# EAGLE design expbox (EAGLE 9.6.2)
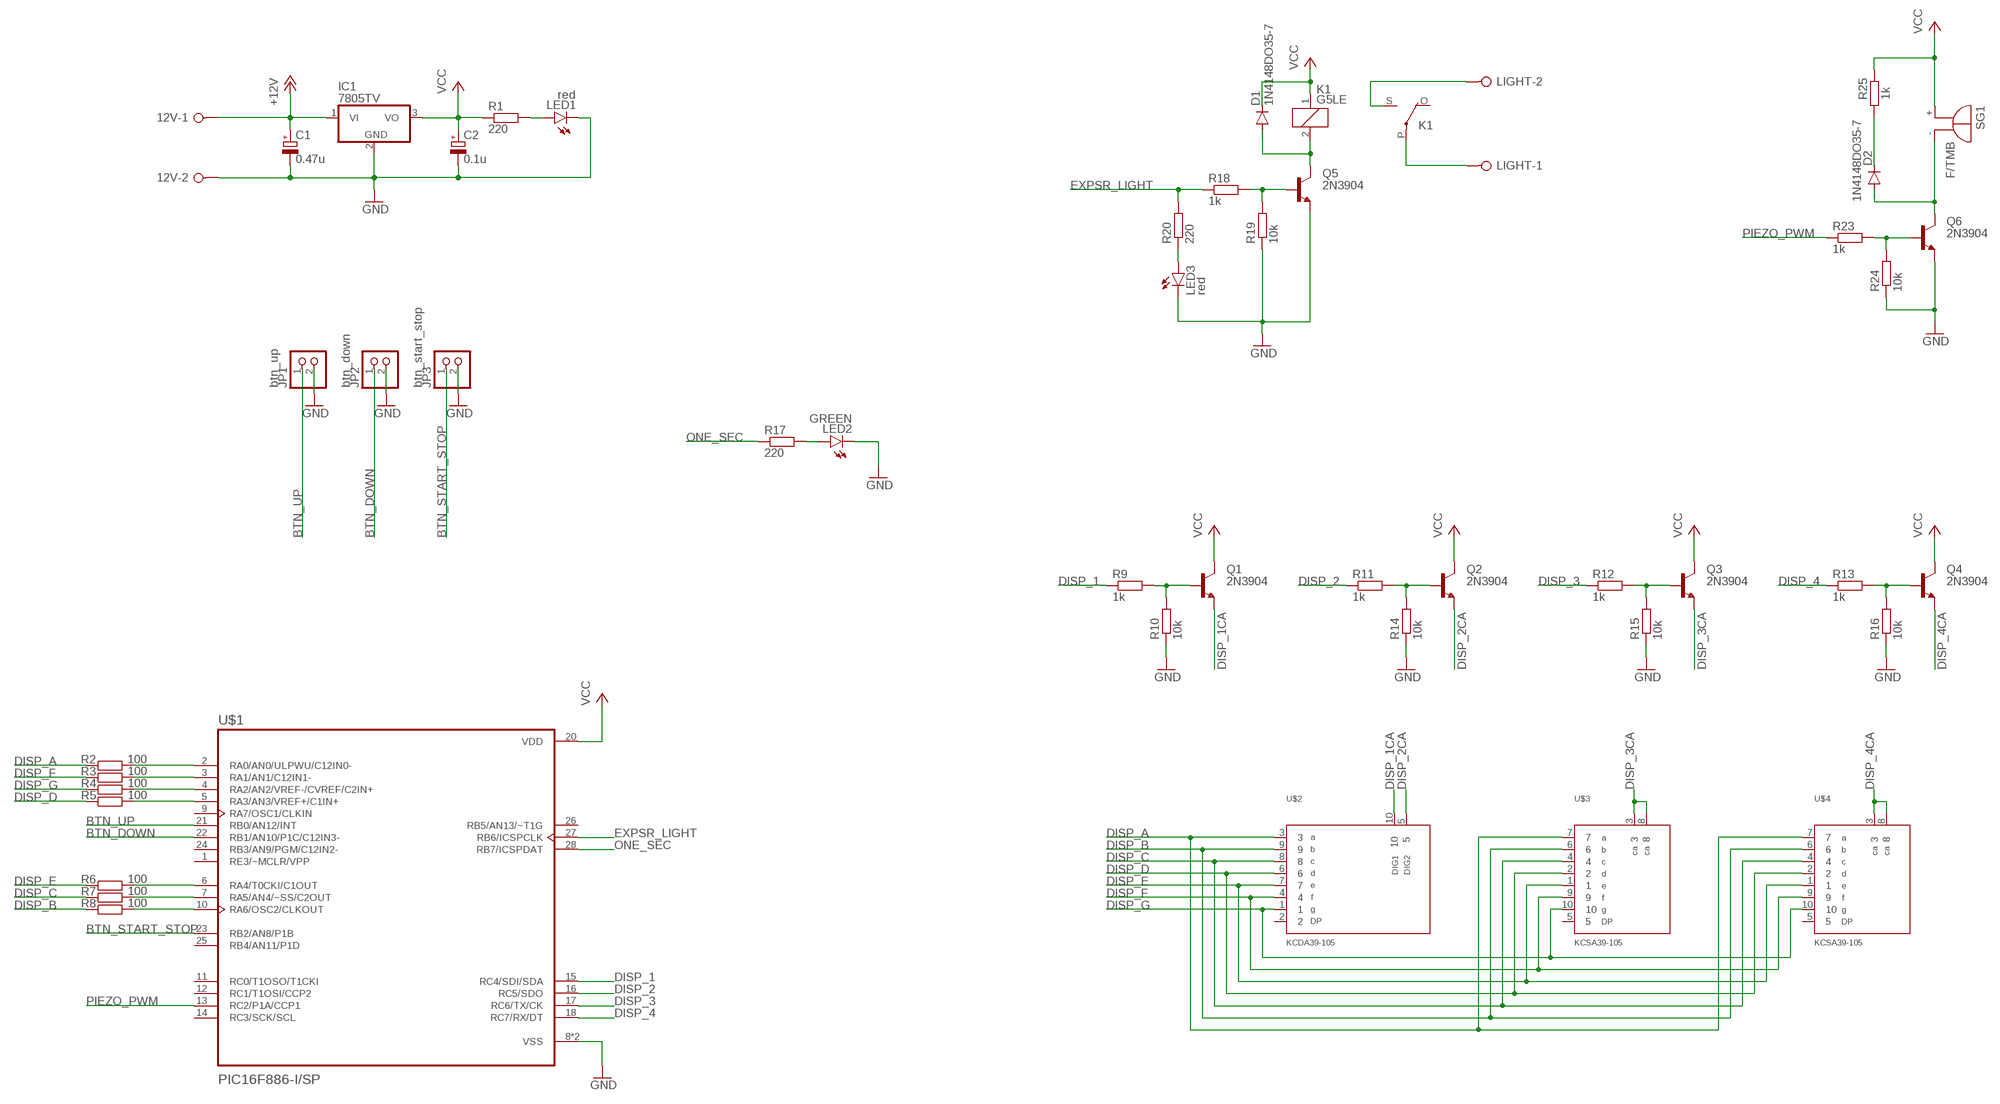
[diagram p0: schematic, sheet 1]

## Parts
12V  W237-02P  [W237-132]
C1  0.47u  CPOL-EUE2.5-5  [E2,5-5]
C2  0.1u  CPOL-EUE2-4  [E2-4]
D1  1N4148DO35-7  [DO35-7]
D2  1N4148DO35-7  [DO35-7]
IC1  7805TV  [TO220V]
JP1  btn_up  PINHD-1X2  [1X02]
JP2  btn_down  PINHD-1X2  [1X02]
JP3  btn_start_stop  PINHD-1X2  [1X02]
K1  G5LE  [G5LE]
LED1  red  LED3MM  [LED3MM]
LED2  GREEN  LEDSMT1206  [1206]
LED3  red  LED3MM  [LED3MM]
LIGHT  W237-02P  [W237-132]
Q1  2N3904  BC850SMD  [SOT23-BEC]
Q2  2N3904  BC850SMD  [SOT23-BEC]
Q3  2N3904  BC850SMD  [SOT23-BEC]
Q4  2N3904  BC850SMD  [SOT23-BEC]
Q5  2N3904  BC850SMD  [SOT23-BEC]
Q6  2N3904  BC850SMD  [SOT23-BEC]
R1  220  R-EU_R0805  [R0805]
R2  100  R-EU_M1206  [M1206]
R3  100  R-EU_M1206  [M1206]
R4  100  R-EU_M1206  [M1206]
R5  100  R-EU_M1206  [M1206]
R6  100  R-EU_M1206  [M1206]
R7  100  R-EU_M1206  [M1206]
R8  100  R-EU_M1206  [M1206]
R9  1k  R-EU_R0805  [R0805]
R10  10k  R-EU_R0805  [R0805]
R11  1k  R-EU_R0805  [R0805]
R12  1k  R-EU_R0805  [R0805]
R13  1k  R-EU_R0805  [R0805]
R14  10k  R-EU_R0805  [R0805]
R15  10k  R-EU_R0805  [R0805]
R16  10k  R-EU_R0805  [R0805]
R17  220  R-EU_R0805  [R0805]
R18  1k  R-EU_R0805  [R0805]
R19  10k  R-EU_R0805  [R0805]
R20  220  R-EU_R0805  [R0805]
R23  1k  R-EU_R0805  [R0805]
R24  10k  R-EU_R0805  [R0805]
R25  1k  R-EU_R0805  [R0805]
SG1  F/TMB  [F/TMB]
U$1  PIC16F886-I/SP  [DIP762W46P254L3467H457Q28]
U$2  KCDA39-105  [KCDA39-105]
U$3  KCSA39-105  [KCSA39-105]
U$4  KCSA39-105  [KCSA39-105]

## Nets
+12V: 12V.1 C1.+ IC1.1(VI)
BTN_DOWN: JP2.1 U$1.22(RB1/AN10/P1C/C12IN3-)
BTN_START_STOP: JP3.1 U$1.23(RB2/AN8/P1B)
BTN_UP: JP1.1 U$1.21(RB0/AN12/INT)
DISP_1: R9.1 U$1.15(RC4/SDI/SDA)
DISP_1CA: Q1.E U$2.10
DISP_2: R11.1 U$1.16(RC5/SDO)
DISP_2CA: Q2.E U$2.5
DISP_3: R12.1 U$1.17(RC6/TX/CK)
DISP_3CA: Q3.E U$3.3 U$3.8
DISP_4: R13.1 U$1.18(RC7/RX/DT)
DISP_4CA: Q4.E U$4.3 U$4.8
DISP_A: R2.1 U$2.3 U$3.7 U$4.7
DISP_B: R8.1 U$2.9 U$3.6 U$4.6
DISP_C: R7.1 U$2.8 U$3.4 U$4.4
DISP_D: R5.1 U$2.6 U$3.2 U$4.2
DISP_E: R6.1 U$2.7 U$3.1 U$4.1
DISP_F: R3.1 U$2.4 U$3.9 U$4.9
DISP_G: R4.1 U$2.1 U$3.10 U$4.10
EXPSR_LIGHT: R18.1 R20.2 U$1.27(RB6/ICSPCLK)
GND: 12V.2 C1.- C2.- IC1.2(GND) JP1.2 JP2.2 JP3.2 LED1.K(C) LED2.C LED3.K(C) Q5.E Q6.E R10.1 R14.1 R15.1 R16.1 R19.1 R24.1 U$1.8(VSS) U$1.19(VSS)
N$1: LED1.A R1.2
N$2: R2.2 U$1.2(RA0/AN0/ULPWU/C12IN0-)
N$3: R3.2 U$1.3(RA1/AN1/C12IN1-)
N$4: R4.2 U$1.4(RA2/AN2/VREF-/CVREF/C2IN+)
N$5: R5.2 U$1.5(RA3/AN3/VREF+/C1IN+)
N$6: R6.2 U$1.6(RA4/T0CKI/C1OUT)
N$7: R7.2 U$1.7(RA5/AN4/~SS/C2OUT)
N$8: R8.2 U$1.10(RA6/OSC2/CLKOUT)
N$9: Q2.B R11.2 R14.2
N$10: Q1.B R9.2 R10.2
N$11: Q3.B R12.2 R15.2
N$12: Q4.B R13.2 R16.2
N$13: LED2.A R17.2
N$14: K1.S(2:S) LIGHT.2
N$15: Q5.B R18.2 R19.2
N$16: D1.A K1.2 Q5.C
N$17: K1.P(2:P) LIGHT.1
N$18: LED3.A R20.1
N$21: D2.A Q6.C SG1.-
N$24: Q6.B R23.2 R24.2
N$25: D2.C R25.1
ONE_SEC: R17.1 U$1.28(RB7/ICSPDAT)
PIEZO_PWM: R23.1 U$1.13(RC2/P1A/CCP1)
VCC: C2.+ D1.C IC1.3(VO) K1.1 Q1.C Q2.C Q3.C Q4.C R1.1 R25.2 SG1.+ U$1.20(VDD)
Unconnected: K1.O(2:O) U$1.1(RE3/~MCLR/VPP) U$1.9(RA7/OSC1/CLKIN) U$1.11(RC0/T1OSO/T1CKI) U$1.12(RC1/T1OSI/CCP2) U$1.14(RC3/SCK/SCL) U$1.24(RB3/AN9/PGM/C12IN2-) U$1.25(RB4/AN11/P1D) U$1.26(RB5/AN13/~T1G) U$2.2 U$3.5 U$4.5

## Library data of the parts
12V LIGHT = con-wago-508:W237-02P: WAGO SREW CLAMP; OC_FARNELL: unknown; OC_NEWARK: unknown
C1 C2 = rcl:CPOL-EU: POLARIZED CAPACITOR, European symbol; SPICEPREFIX: C
D1 D2 = diode:1N4148: DIODE high speed (Philips)
IC1 = linear:78*: Positive VOLTAGE REGULATOR Source: http://cache.national.com/ds/LM/LM78L05.pdf http://www.fairchildsemi.com/ds/LM/LM7805.pdf
JP1-JP3 = pinhead:PINHD-1X2: PIN HEADER
K1 = relay:G5LE: RELAY 1 x switch, 10 A/120 V AC, 8 A/30 V DC, Omron; OC_FARNELL: unknown; OC_NEWARK: unknown
LED1-LED3 = led:LED: LED OSRAM: - CHIPLED LG R971, LG N971, LY N971, LG Q971, LY Q971, LO R971, LY R971 LH N974, LH R974 LS Q976, LO Q976, LY Q976 LO Q996 - Hyper CHIPLED LW Q18S LB Q993, LB Q99A, LB R99A - SideLED LS A670, LO A670, LY A670, LG A670, LP A670 LB A673, LV A673, LT A673, LW A673 LH A674 LY A675 LS A676, LA A676, LO A676, LY A676, LW A676 LS A679, LY A679, LG A679 - Hyper Micro SIDELED® LS Y876, LA Y876, LO Y876, LY Y876 LT Y87S - SmartLED LW L88C, LW L88S LB L89C, LB L89S, LG L890 LS L89K, LO L89K, LY L89K LS L896, LA L896, LO L896, LY L896 - TOPLED LS T670, LO T670, LY T670, LG T670, LP T670 LSG T670, LSP T670, LSY T670, LOP T670, LYG T670 LG T671, LOG T671, LSG T671 LB T673, LV T673, LT T673, LW T673 LH T674 LS T676, LA T676, LO T676, LY T676, LB T676, LH T676, LSB T676, LW T676 LB T67C, LV T67C, LT T67C, LS T67K, LO T67K, LY T67K, LW E67C LS E67B, LA E67B, LO E67B, LY E67B, LB E67C, LV E67C, LT E67C LW T67C LS T679, LY T679, LG T679 LS T770, LO T770, LY T770, LG T770, LP T770 LB T773, LV T773, LT T773, LW T773 LH T774 LS E675, LA E675, LY E675, LS T675 LS T776, LA T776, LO T776, LY T776, LB T776 LHGB T686 LT T68C, LB T68C - Hyper Mini TOPLED® LB M676 - Mini TOPLED Santana® LG M470 LS M47K, LO M47K, LY M47K Source: http://www.osram.convergy.de LUXEON: - LUMILED® LXK2-PW12-R00, LXK2-PW12-S00, LXK2-PW14-U00, LXK2-PW14-V00 LXK2-PM12-R00, LXK2-PM12-S00, LXK2-PM14-U00 LXK2-PE12-Q00, LXK2-PE12-R00, LXK2-PE12-S00, LXK2-PE14-T00, LXK2-PE14-U00 LXK2-PB12-K00, LXK2-PB12-L00, LXK2-PB12-M00, LXK2-PB14-N00, LXK2-PB14-P00, LXK2-PB14-Q00 LXK2-PR12-L00, LXK2-PR12-M00, LXK2-PR14-Q00, LXK2-PR14-R00 LXK2-PD12-Q00, LXK2-PD12-R00, LXK2-PD12-S00 LXK2-PH12-R00, LXK2-PH12-S00 LXK2-PL12-P00, LXK2-PL12-Q00, LXK2-PL12-R00 Source: www.luxeon.com KINGBRIGHT: KA-3528ASYC Source: www.kingbright.com
Q1-Q6 = transistor-npn:BC850*: NPN Transistor
R1-R20 R23-R25 = rcl:R-EU_: RESISTOR, European symbol; SPICEPREFIX: R
SG1 = buzzer:F/TMB: BUZZER Source: Buerklin; OC_FARNELL: unknown; OC_NEWARK: unknown
U$1 = PIC16F886-I_SP:PIC16F886-I/SP: Check prices <https://pricing.snapeda.com/search/part/PIC16F886-I/SP/?ref=eda>; AVAILABILITY: Good; DESCRIPTION: PIC PIC® 16F Microcontroller IC 8-Bit 20MHz 14KB (8K x 14) FLASH 28-SPDIP; MF: Microchip; MP: PIC16F886-I/SP; PACKAGE: DIP-28 Microchip; PRICE: None; PURCHASE-URL: https://pricing.snapeda.com/search/part/PIC16F886-I/SP/?ref=eda
U$2 = abobija:KCDA39-105: CA SMD 2 digit seven segment display
U$3 U$4 = abobija:KCSA39-105: CA SMD 7 segment display

## Board
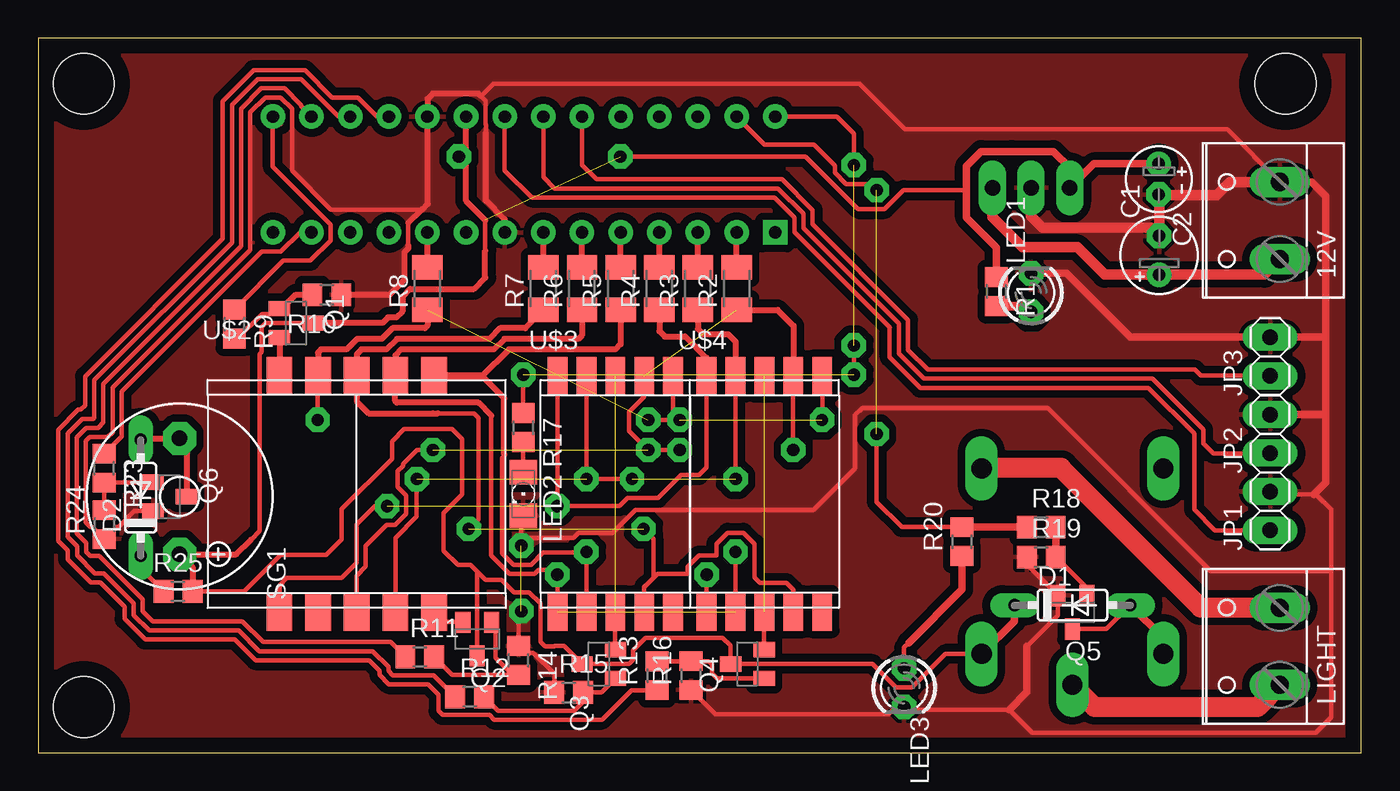
[diagram p1: board, top side]
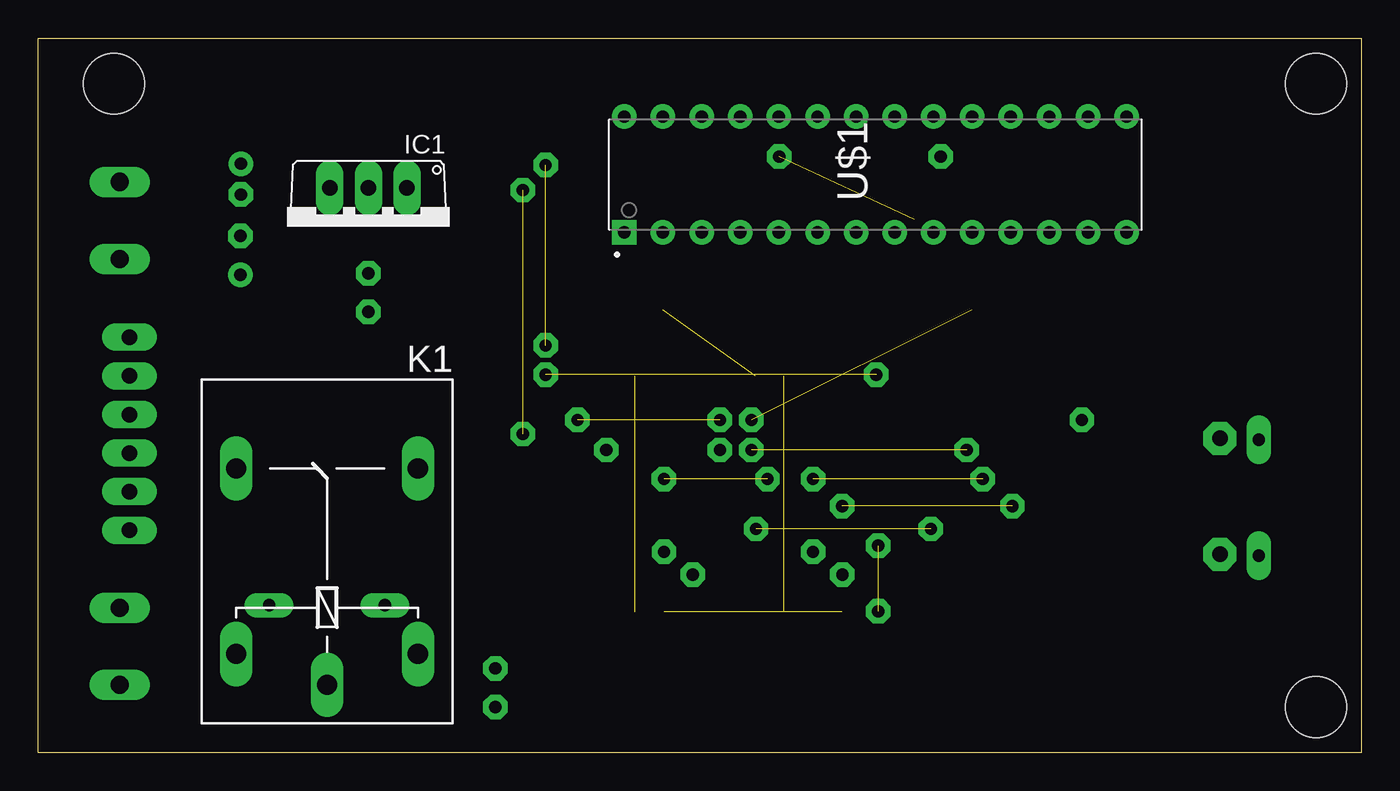
[diagram p2: board, bottom side, seen from below]

Size 87 x 47 mm. Coordinates in mm from the lower left corner, seen from the top.
Outline: 0,0 87,0 87,47 0,47 0,0
Copper layers (1*16): Top 0.035mm / dielectric 1.5mm / Bottom 0.035mm
Design rules "default *": minimum track width 0.3mm, minimum drill 0.35mm, track to track 0.3mm, track to pad 0.3mm, pad to pad 0.3mm, via to via 0.3mm, smd to smd 0.3mm, copper to edge 40mil, drill to drill 6mil, minimum pad ring 0.4mm, minimum via ring 0.4mm, stop-mask expansion 4mil, vias tented up to drill 0mil, thermal gap 10mil
Holes 4 mm at 3,3 3,44 82,44

### Footprints (pad centres in the part's own frame; a part is rotated, then mirrored left to right if it is on the bottom)
W237-132 = drill 1.194 long: 1 -2.54,-0.635; 2 2.54,-0.635
E2,5-5 = drill 0.813 pad 1.6: + -1.27,0 | drill 0.813 pad 1.6 octagon: - 1.27,0
E2-4 = drill 0.813 pad 1.27: + -1.016,0 | drill 0.813 pad 1.27 octagon: - 1.016,0
DO35-7 = drill 0.813 long: A 3.81,0; C -3.81,0
TO220V = drill 1.016 long: 1 -2.54,-2.54; 2 0,-2.54; 3 2.54,-2.54
1X02 = drill 1.016 long: 1 -1.27,0; 2 1.27,0
G5LE = drill 1.321 long: 1 -7.493,-5.969; 2 -7.493,5.969; O 4.699,5.969; P -9.525,0; S 4.699,-5.969
LED3MM = drill 0.813 octagon: A -1.27,0; K 1.27,0
1206 = smd 1.6 x 1.803: A -1.422,0; C 1.422,0
SOT23-BEC = smd 1 x 1.4: B -0.95,-1.1; C 0,1.1; E 0.95,-1.1
R0805 = smd 1.3 x 1.5: 1 -0.95,0; 2 0.95,0
M1206 = smd 1.6 x 2: 1 -1.4,0; 2 1.4,0
F/TMB = drill 1.016 pad 2.159 octagon: + 3.81,0; - -3.81,0
DIP762W46P254L3467H457Q28 = drill 0.813 square: 1 -3.81,16.51 | drill 0.813: 2 -3.81,13.97; 3 -3.81,11.43; 4 -3.81,8.89; 5 -3.81,6.35; 6 -3.81,3.81; 7 -3.81,1.27; 8 -3.81,-1.27; 9 -3.81,-3.81; 10 -3.81,-6.35; 11 -3.81,-8.89; 12 -3.81,-11.43; 13 -3.81,-13.97; 14 -3.81,-16.51; 15 3.81,-16.51; 16 3.81,-13.97; 17 3.81,-11.43; 18 3.81,-8.89; 19 3.81,-6.35; 20 3.81,-3.81; 21 3.81,-1.27; 22 3.81,1.27; 23 3.81,3.81; 24 3.81,6.35; 25 3.81,8.89; 26 3.81,11.43; 27 3.81,13.97; 28 3.81,16.51
KCDA39-105 = smd 1.7 x 2.5: 1 -5.08,-7.75; 2 -2.54,-7.75; 3 0,-7.75; 4 2.54,-7.75; 5 5.08,-7.75; 6 5.08,7.75; 7 2.54,7.75; 8 0,7.75; 9 -2.54,7.75; 10 -5.08,7.75
KCSA39-105 = smd 1.3 x 2.5: 1 -3.8,-7.75; 2 -1.9,-7.75; 3 0,-7.75; 4 1.9,-7.75; 5 3.8,-7.75; 6 3.8,7.75; 7 1.9,7.75; 8 0,7.75; 9 -1.9,7.75; 10 -3.8,7.75

### Placement (x,y rotation side)
12V  81,35 90 top
C1  73.7,32.71 90 top
C2  73.67,37.72 270 top
D1  68,9.71 0 top
D2  6.75,16.77 90 top
IC1  65.28,34.61 180 bottom
JP1  81,15.9 90 top
JP2  81,20.97 90 top
JP3  81,26.06 90 top
K1  68,13.99 90 bottom
LED1  65.28,30.26 90 top
LED2  31.9,17.02 270 top
LED3  56.93,4.28 270 top
LIGHT  81,7 90 top
Q1  16.96,28.26 270 top
Q2  28.87,7.48 180 top
Q3  36.86,5.84 90 top
Q4  46.63,5.84 90 top
Q5  67.99,9.24 180 top
Q6  8.66,16.84 270 top
R1  63,30.33 270 top
R2  45.92,30.52 90 top
R3  43.38,30.52 90 top
R4  40.84,30.52 90 top
R5  38.3,30.52 90 top
R6  35.76,30.52 90 top
R7  33.22,30.52 90 top
R8  25.6,30.52 90 top
R9  12.91,28.19 270 top
R10  18.99,30.12 180 top
R11  25.09,6.31 0 top
R12  28.37,3.69 0 top
R13  40.69,5.07 90 top
R14  31.58,6.08 270 top
R15  34.88,3.97 0 top
R16  42.92,5.08 90 top
R17  31.9,21.39 270 top
R18  65.95,14.84 0 top
R19  65.95,12.87 0 top
R20  60.73,13.89 90 top
R23  4.34,18.71 270 top
R24  4.36,15 90 top
R25  9.21,10.61 0 top
SG1  9.31,16.86 270 top
U$1  31.95,38.02 90 bottom
U$2  20.95,17.02 0 top
U$3  37.95,17.02 0 top
U$4  47.75,17.02 0 top

### Tracks (layer width: path | path; a pad name or v marks a point on that pad's centre or on a via)
+12V
  Top 0.7: 12V.1 80.61,31.44 C1.+ 70.12,31.44 68.32,33.24 64.72,33.24 62.74,35.22 IC1.1
BTN_DOWN
  Top 0.3: U$1.22 33.22,37.84 33.95,37.11 48.66,37.11 50.32,35.45 50.32,34.5 56.6,28.22 56.6,26.25 58.25,24.6 73.25,24.6 76.6,21.25 76.6,20.34 77.27,19.67 80.97,19.67 JP2.1
BTN_START_STOP
  Top 0.3: U$1.23 35.76,38.65 36.7,37.71 48.91,37.71 50.92,35.7 50.92,34.75 57.2,28.47 57.2,26.5 58.5,25.2 76.05,25.2 76.45,24.8 JP3.1
BTN_UP
  Top 0.3: U$1.21 30.68,38.29 32.46,36.51 48.41,36.51 49.72,35.2 49.72,34.25 55.98,27.98 | JP1.1 77.37,14.63 76,16 76,21 73,24 58,24 55.98,26.02 55.98,27.98 | 56,27.97 55.98,27.98
DISP_1
  Top 0.3: 15.95,41.32 U$1.15 15.44,38.53 19.24,34.73 19.24,33.69 17.9,32.35 16.12,32.35 R9.1
DISP_1CA
  Top 0.4: Q1.E U$2.10
DISP_2
  Top 0.3: U$1.16 17.3,42.51 17.3,42.6 16.21,43.69 14.67,43.69 13.35,42.37 13.35,33.31 4.29,24.26 4.29,21.7 3.95,21.36 3.15,21.36 2.54,20.75 2.54,14.43 3.16,13.81 3.16,13.21 3.42,12.95 4.02,12.95 6.89,10.08 6.89,9.3 7.54,8.65 13.43,8.65 14.8,7.28 17.42,7.28 | 17.42,7.28 17.45,7.31 | 17.42,7.28 23.17,7.28 R11.1
DISP_2CA
  Top 0.3: Q2.E 27.88,8.62 26.12,8.62 26.03,8.71 U$2.5
DISP_3
  Top 0.3: U$1.17 19.76,41.83 17.3,44.29 14.42,44.29 12.75,42.61 12.75,33.56 3.69,24.51 3.69,22.02 3.63,21.96 2.91,21.96 1.94,20.99 1.94,14.18 2.56,13.56 2.56,12.96 3.73,11.8 4.32,11.8 6.29,9.83 6.29,9.05 7.29,8.05 13.18,8.05 14.55,6.68 22,6.68 23.04,5.64 23.04,5.37 23.3,5.11 26,5.11 R12.1
DISP_3CA  (1 unrouted)
  Top 0.3: Q3.E 37.94,6.81 U$3.3
  Top 0.5: U$3.3
DISP_4
  Top 0.3: U$1.18 22.3,41.83 21.04,43.09 19.35,43.09 17.55,44.89 14.17,44.89 12.15,42.86 12.15,33.81 3.09,24.75 3.09,22.85 2.8,22.56 2.66,22.56 1.34,21.24 1.34,13.93 1.96,13.31 1.96,12.72 3.48,11.2 4.07,11.2 5.69,9.58 5.69,8.8 7.04,7.45 12.93,7.45 14.3,6.08 21.75,6.08 22.44,5.39 22.44,5.12 23.05,4.51 25.63,4.51 26.32,3.82 26.32,2.75 26.58,2.49 29.67,2.49 29.99,2.17 37.08,2.17 39.03,4.12 R13.1
DISP_4CA  (1 unrouted)
  Top 0.3: Q4.E 47.73,9.25 U$4.3
  Top 0.5: U$4.8
DISP_A  (via drill 0.8 pad 1.5)  (2 unrouted)
  Top 0.3: v42.18,19.91 v40.11,19.91 38.86,21.16 38.86,22.41 39.85,23.4 U$3.7 | U$2.3 20.95,11.64 21.55,12.24 21.55,13.62 22.9,14.97 23.47,14.97 24.2,15.7 24.2,16.93 23.65,17.48 23.65,18.52 24,18.87 24,19 24.91,19.91 v25.95,19.91 | v49.64,19.91 49.64,24.99 49.67,25.02
  Top 0.4: R2.1 48.62,29.12 49.67,28.07 49.67,25.02 49.67,24.48 49.64,24.45
  Top 0.5: 49.64,24.45 U$4.7
DISP_B  (via drill 0.8 pad 1.5)  (2 unrouted)
  Top 0.3: v18.38,21.89 18.38,24.76 U$2.9 | U$3.6 41.75,22.32 v42.18,21.89 v40.11,21.89 | U$4.6 v51.55,21.9 v51.54,21.89
  Top 0.4: R8.1 25.6,28.09 25.43,27.92 23.3,27.92 22.6,27.22 20.98,27.22 20.28,26.52 18.61,26.52 18.4,26.31 U$2.9
  Top 0.5: 41.72,24.74 U$3.6
DISP_C  (via drill 0.8 pad 1.5)  (1 unrouted)
  Top 0.3: 25.95,22.32 28.65,22.32 28.95,22.02 28.95,15.36 v28.31,14.72 | U$3.4 39.85,10.92 | 39.85,10.92 39.95,11.02 | 39.85,10.92 39.86,10.92 40.45,11.52 | U$4.4 49.65,10.72 49.2,11.17 47.46,11.17 47.1,11.53 47.1,13.74 46.37,14.47 45.33,14.47 44.6,13.74 44.6,12.98 44.59,12.97 43.44,12.97 42.71,12.24 42.71,11.77 40.71,11.77 40.45,11.52 | v39.8,14.72 40.45,14.06 40.45,11.52
  Top 0.4: R7.1 32.02,27.92 30.37,27.92 29.67,27.22 23.59,27.22 22.89,26.52 21.27,26.52 20.95,26.2 20.95,24.02 | U$2.8 20.95,23.11 21.74,22.32 25.95,22.32 26.28,22.32
  Top 0.5: 39.84,10.13 39.95,10.02 39.95,9.37 | 39.95,9.37 U$3.4 | U$2.8 20.95,24.02 | 39.8,9.52 39.95,9.37
DISP_D  (via drill 0.8 pad 1.5)  (1 unrouted)
  Top 0.3: U$3.2 v36.05,13.22 36,13.17 33.21,13.17 32.41,12.37 31.25,12.37 30.52,13.1 30.52,19.4 30.65,19.53 30.65,19.6 | U$4.2 v45.85,13.22
  Top 0.4: R5.1 38.3,26.87 37.95,26.52 30.95,26.52 29.2,24.77 30.65,23.32 30.65,19.6
  Top 0.5: U$2.6 29.2,24.77
DISP_E  (via drill 0.8 pad 1.5)  (1 unrouted)
  Top 0.3: U$4.1 v43.95,11.71 v43.96,11.72 | v34.13,11.72 34.15,11.7 U$3.1 | 34.11,11.7 v34.13,11.72 | v34.13,11.72 33.83,12.02 32.91,12.02 32.66,11.77 31,11.77 29.8,12.97 29.8,22.17
  Top 0.4: R6.1 35.76,27.45 35.53,27.22 30.66,27.22 29.96,26.52 23.88,26.52 23.49,26.13 U$2.7 23.48,23.13 23.59,23.02 28.95,23.02 29.8,22.17
  Top 0.5: U$3.1 34.13,9.29
DISP_F  (via drill 0.8 pad 1.5)  (2 unrouted)
  Top 0.3: U$4.9 | U$2.4 23.49,14.14 24.9,15.55 v24.9,18 | U$3.9 v36.05,18 v39.05,18 | v45.86,18 45.86,24.99 45.85,25
  Top 0.4: R3.1 43.38,27.88 43.73,27.53 45.36,27.53 45.85,27.04 45.85,25 U$4.9
DISP_G  (via drill 0.8 pad 1.5)  (1 unrouted)
  Top 0.3: v34.14,16.22 U$3.10 | U$2.1 15.87,11.02 16.34,11.49 19.95,11.49 20.95,12.49 20.95,15.02 22.15,16.22 v22.95,16.22 | v34.15,16.21 v34.14,16.22 | U$4.10 43.95,18.76 43.45,18.26 42.26,18.26 40.75,16.75 38.75,16.75 38.22,16.22 v34.14,16.22
  Top 0.4: R4.1 40.84,27.73 41.2,27.37 42.5,27.37 42.52,27.39 43.95,25.96 U$4.10 | U$2.1 15.95,9.35
  Top 0.5: U$3.10 34.12,24.74
EXPSR_LIGHT  (via drill 0.8 pad 1.5)  (1 unrouted)
  Top 0.3: v55.13,20.96 55.13,16.5 56.79,14.84 R20.2 | U$1.27 47.75,40 51,40 52.38,38.62 52.38,38.13 53.11,37.4 54.73,37.4 v55.13,37
  Top 0.5: R18.1 R20.2
GND  (via drill 0.8 pad 1.5)  (1 unrouted)
  Top 0.3: 29.44,40.77 29.44,41.29 29.42,41.31 29.42,42.87 29.11,43.18 29.93,44 54,44 57,41 78.17,41 12V.2 | 24.1,32.93 24.34,33.17 24.34,34.83 | Q6.E 6.34,15.89 5.3,14.85 5.16,14.85 R24.1 3.56,14.85 3.42,14.85 3.14,15.13 3.14,20.5 3.4,20.76 4.59,20.76 4.89,21.06 4.89,24.01 13.95,33.06 13.95,42.12 14.92,43.09 15.96,43.09 16.7,42.35 16.7,38.27 19.24,35.73 25.24,35.73 | LED2.C 31.77,15.47 v31.77,13.62 32.29,14.14 35.2,14.14 35.53,14.47 37.78,14.47 39.28,15.97 50.97,15.97 53.71,18.71 53.71,22.2 54.19,22.68 66.37,22.68 77.11,11.94 85,11.94 | 31.89,9.19 v31.77,9.31 31.58,9.12 R14.1 32.03,6.58 32.55,6.58 33.95,5.18 33.95,3.99 R15.1 | R19.1 65,12.38 Q5.E 67.04,9.04 65,7 | R16.1 44.53,2.52 55.89,2.52 56.38,3.01 LED3.K 57.1,2.84 63.84,2.84 65.35,1.33 84,1.33 85,2.33 85,11.94 | JP1.2 81.17,17 83.88,17 84,17 85,16 85,11.94
  Top 0.4: 31.89,15.59 LED2.C | U$1.8 30.68,35.06 29.44,36.3 29.44,40.77 | 29.11,43.18 28.94,43.35 25.97,43.35 25.6,42.98 U$1.19 25.62,41.81 25.62,36.11 25.24,35.73 24.34,34.83 | R10.1 23.1,30.12 24.1,31.12 24.1,32.93 24.35,33.18 24.35,33.33
  Top 0.5: 65,7 65,4 63.84,2.84 | R24.1 4.64,14.05 | 12V.2 83.72,37.54 84.65,36.61 84.65,27.25 | 84.65,27.25 84.65,22.22 | 84.65,22.22 84.65,17.77 83.88,17 | JP2.2 84.63,22.24 84.65,22.22 | 84.65,27.25 84.57,27.33 JP3.2 71.79,27.33 67.59,31.53 LED1.K
  Top 0.7: 12V.2 78.36,37.54 77.49,36.67 73.7,36.67 C2.- 73.7,36.67 C1.- 73.15,34.53 66.03,34.53 65.28,35.28 IC1.2
  Bottom 0.3: JP3.2 81.03,27.3
  pour Top (isolate 0.5): 0,47 0,0 87,0 87,47
N$1
  Top 0.6: R1.2 64.89,29.38 LED1.A
N$2
  Top 0.4: R2.2 U$1.2
N$3
  Top 0.4: R3.2 U$1.3
N$4
  Top 0.4: R4.2 U$1.4
N$5
  Top 0.4: R5.2 U$1.5
N$6
  Top 0.4: R6.2 U$1.6
N$7
  Top 0.4: R7.2 U$1.7
N$8
  Top 0.4: R8.2 U$1.10
N$9
  Top 0.3: 30.01,8.39 Q2.B 30.08,8.32 30.08,6.25 31.2,5.13 R14.2 27.22,5.13 R11.2
N$10
  Top 0.3: Q1.B 15.51,28.86 14.72,28.86 13.11,27.24 R9.2
  Top 0.4: R10.2 16.94,30.12 16.03,29.21 Q1.B 15.82,29.17
N$11
  Top 0.3: Q3.B 37.04,3.97 R15.2 35.83,3.35 35.25,2.77 30.24,2.77 R12.2 29.33,3.69
N$12
  Top 0.3: Q4.B 44.64,4.89 44.3,5.23 44.3,5.82 44.09,6.03 R16.2 R13.2
N$13
  Top 0.3: LED2.A R17.2
N$14
  Top 1.3: LIGHT.2 76.43,9.54 67.24,18.73 62.07,18.73 K1.S
N$15
  Top 0.3: Q5.B 68.94,10.83 R19.2
  Top 0.5: R18.2 R19.2 67.17,12.87
N$16
  Top 0.3: Q5.C 70.24,8.14 D1.A
  Top 0.5: K1.2 73.97,7.55 D1.A
N$17
  Top 1.3: LIGHT.1 80.17,3 69.47,3 K1.P
N$18
  Top 0.3: 57.24,7.24 56.93,6.93 LED3.A
  Top 0.5: R20.1 60.73,10.73 57.24,7.24
N$21
  Top 0.4: D2.A 6.84,20.67 SG1.- 9.76,20.22 Q6.C
N$24
  Top 0.3: R24.2 4.34,15.97 R23.2 7.54,17.77
  Top 0.5: 7.54,17.77 Q6.B
N$25
  Top 0.3: R25.1 6.75,12.12 D2.C
ONE_SEC  (via drill 0.8 pad 1.5)  (2 unrouted)
  Top 0.3: R17.1 v31.9,24.86 | v53.63,38.65 53.63,40.72 52.51,41.84 U$1.28 | v53.63,26.79 v53.63,24.86
PIEZO_PWM
  Top 0.3: R23.1 5.49,20.81 5.49,23.76 14.69,32.95 15.96,32.95 17.22,34.21 U$1.13
VCC  (via drill 0.8 pad 1.5)  (1 unrouted)
  Top 0.3: 29.4,33.02 29.4,35.02 29.4,35.05 | R25.2 13.54,10.61 15.95,13.02 18.95,13.02 19.95,14.02 19.95,16.02 23.26,19.33 23.26,20.48 24.08,21.3 27.21,21.3 27.87,20.64 27.87,16.99 26.66,15.78 26.66,13.29 27.6,12.35 28.45,12.35 28.86,11.94 | 28.87,11.93 29.42,11.38 30.49,11.38 31.31,10.56 32.29,10.56 33.02,9.83 33.02,7.31 33.32,7.01 33.94,7.01 33.95,7.02 34.58,7.02 Q3.C 38.85,5.84 39.11,6.1 39.11,6.73 39.95,7.57 45.01,7.57 45.53,7.05 Q4.C 54.86,5.84 56.41,4.29 57.45,4.29 59.65,6.5 K1.1 | 28.85,11.92 28.86,11.94 | Q1.C 14.97,28.26 14.71,28 14.71,26.35 14.57,26.21 14.57,14.58 13.99,14.01 13.59,13.6 | 64,39.54 64,39.6 | v27.66,39.21 27.95,39.21 28.14,39.02 | v38.28,39.21 50.45,39.21 53.91,35.75 55.65,35.75 56.9,37 61.03,37 | Q2.C 28.87,11.93 | 28.87,11.93 28.86,11.94
  Top 0.4: Q1.C 22.65,28.26 23.01,28.62 23.55,28.62 23.95,29.02 23.95,29.98 24.47,30.5 28.66,30.5 29.4,31.24 | 29.41,31.25 29.4,31.24 | 29.4,31.24 29.4,33.02 29.42,33.02 | 29.4,35.02 28.14,36.28 28.14,39.02 U$1.20 | R25.2 10.16,12.2 SG1.+ 13.04,13.05 13.99,14.01
  Top 0.5: R1.1 63,33.23 61.03,35.2 61.03,37 61.03,38.58 61.99,39.54 64,39.54 66.74,39.54 67.85,38.43 67.85,37.18 | 67.85,37.18 IC1.3 | Q2.C 29.12,6.33 | K1.1 64.19,8.66 D1.C | C2.+ 69.41,38.74 67.85,37.18

### Text on the board
tRestrict: Alija Bobija | expbox